# Altium schematic sheet Raspberry Pi2+ Expansion Slot.SchDoc
size A4
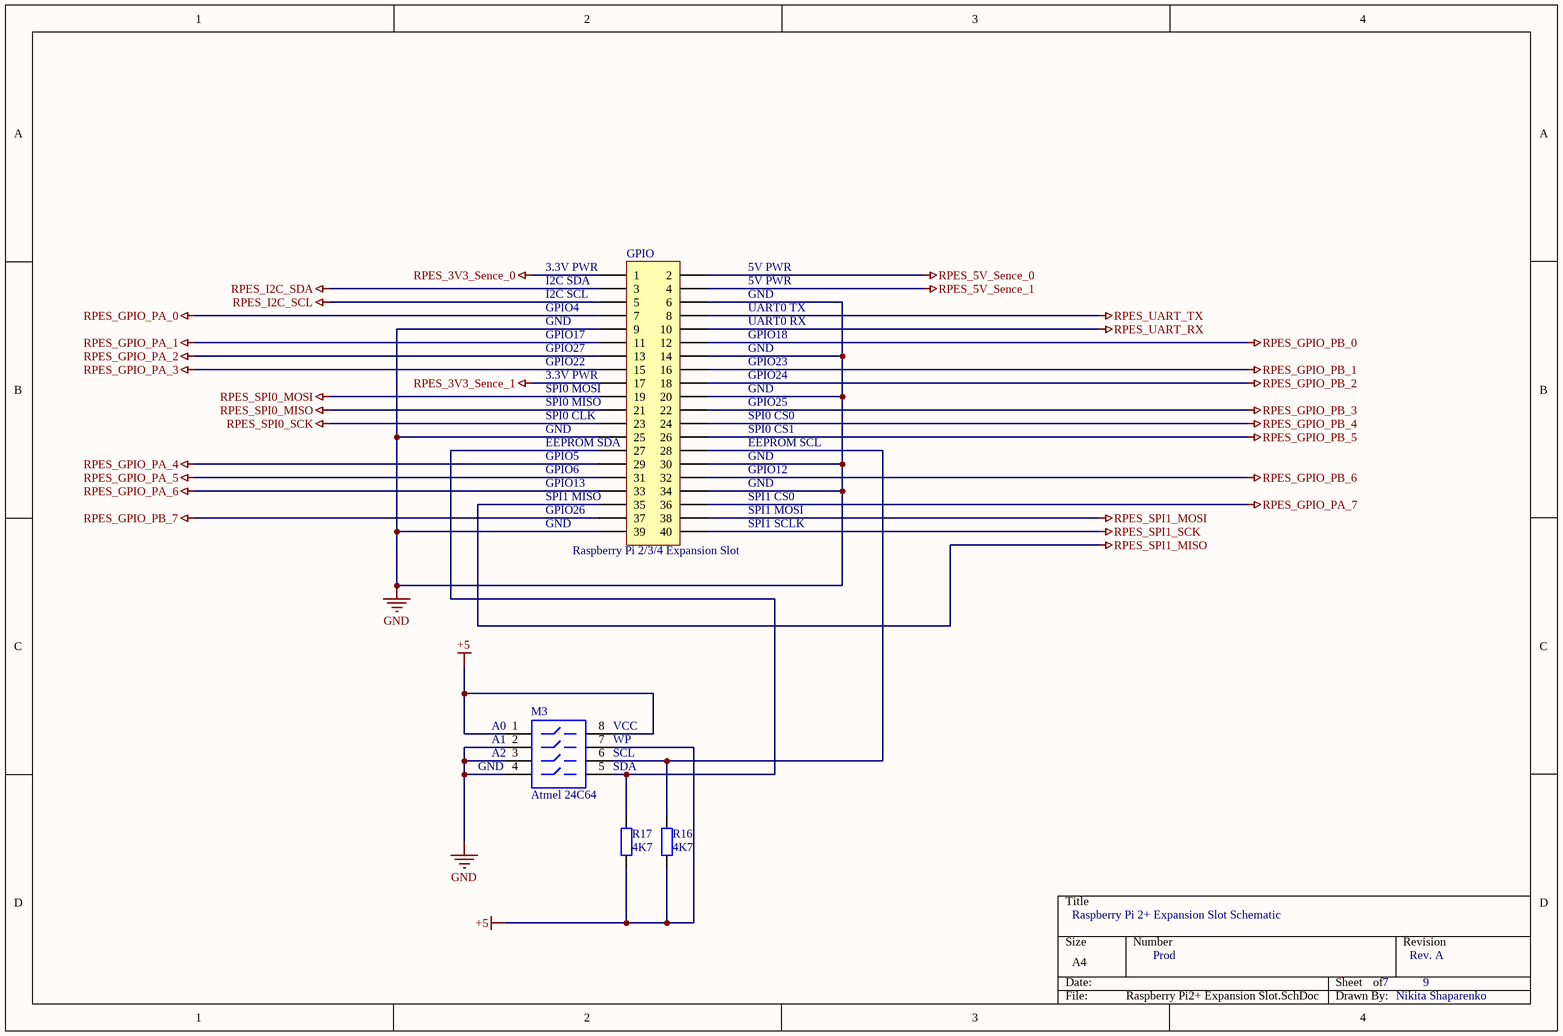
[diagram p0: Raspberry Pi2+ Expansion Slot.SchDoc]

## Parts
GPIO  Raspberry Pi 2/3/4 Expansion Slot  [HDR2X20]
M3  Atmel 24C64  [DIP-8]
R16  value 4K7  [AXIAL-0.4]  (hidden comment: Res2)
R17  value 4K7  [AXIAL-0.4]  (hidden comment: Res2)

## Nets
+5: M3.1 M3.7 M3.8 R16.1 R17.1
GND: GPIO.6 GPIO.9 GPIO.14 GPIO.20 GPIO.25 GPIO.30 GPIO.34 GPIO.39 M3.2 M3.3 M3.4
RPES_3V3_Sence_0: GPIO.1
RPES_3V3_Sence_1: GPIO.17
RPES_5V_Sence_0: GPIO.2
RPES_5V_Sence_1: GPIO.4
RPES_GPIO_PA_0: GPIO.7
RPES_GPIO_PA_1: GPIO.11
RPES_GPIO_PA_2: GPIO.13
RPES_GPIO_PA_3: GPIO.15
RPES_GPIO_PA_4: GPIO.29
RPES_GPIO_PA_5: GPIO.31
RPES_GPIO_PA_6: GPIO.33
RPES_GPIO_PA_7: GPIO.36
RPES_GPIO_PB_0: GPIO.12
RPES_GPIO_PB_1: GPIO.16
RPES_GPIO_PB_2: GPIO.18
RPES_GPIO_PB_3: GPIO.22
RPES_GPIO_PB_4: GPIO.24
RPES_GPIO_PB_5: GPIO.26
RPES_GPIO_PB_6: GPIO.32
RPES_GPIO_PB_7: GPIO.37
RPES_I2C_SCL: GPIO.5
RPES_I2C_SDA: GPIO.3
RPES_SPI0_MISO: GPIO.21
RPES_SPI0_MOSI: GPIO.19
RPES_SPI0_SCK: GPIO.23
RPES_SPI1_MISO: GPIO.35
RPES_SPI1_MOSI: GPIO.38
RPES_SPI1_SCK: GPIO.40
RPES_UART_RX: GPIO.10
RPES_UART_TX: GPIO.8
NetGPIO_27: GPIO.27 M3.5 R17.2
NetGPIO_28: GPIO.28 M3.6 R16.2

## Notes on the sheet
- (near GPIO) 3.3V PWR
- (near GPIO) I2C SDA
- (near GPIO) I2C SCL
- (near GPIO) GPIO4
- 5V PWR
- GND
- UART0 TX
- (near GPIO) GPIO17
- (near GPIO) GPIO27
- (near GPIO) GPIO22
- UART0 RX
- GPIO18
- GPIO23
- GPIO24
- (near GPIO) SPI0 MOSI
- (near GPIO) SPI0 MISO
- (near GPIO) SPI0 CLK
- (near GPIO) EEPROM SDA
- GPIO25
- SPI0 CS0
- SPI0 CS1
- EEPROM SCL
- (near GPIO) GPIO5
- (near GPIO) GPIO6
- (near GPIO) GPIO13
- (near GPIO) SPI1 MISO
- (near GPIO) GPIO26
- GPIO12
- SPI1 CS0
- SPI1 MOSI
- SPI1 SCLK
- (near M3) GND
- (near M3) A0
- (near M3) A1
- (near M3) A2
- (near M3) SDA
- (near M3) SCL
- (near M3) WP
- (near M3) VCC
- Raspberry Pi 2+ Expansion Slot Schematic
- Prod
- 7
- Rev. A
- 9
- Nikita Shaparenko

## Library data of the parts
GPIO = Header 20X2: Header, 20-Pin, Dual row; LatestRevisionDate: 17-Jul-2002; LatestRevisionNote: Re-released for DXP Platform.; Publisher: Altium Limited
M3 = SW-DIP4: DIP Switch; Published: 24-Mar-1999; LatestRevisionDate: 17-Jul-2002; LatestRevisionNote: Re-released for DXP Platform.; PackageReference: DIP-8; Publisher: Altium Limited
R16 R17 = Res2: Resistor; Published: 8-Jun-2000; LatestRevisionDate: 17-Jul-2002; LatestRevisionNote: Re-released for DXP Platform.; PackageReference: AXIAL-0.4; Publisher: Altium Limited; PackageDescription: Axial Device, Thru-Hole; 2 Leads; 0.4 in Pin Spacing